# EasyEDA schematic 1-Schematic_Plawas-m.json
TITLE: Sheet_1; REV: 1.0; Date: 2019-08-25; Sheet: 1/1; Drawn By: dchamel; Company: Your Company
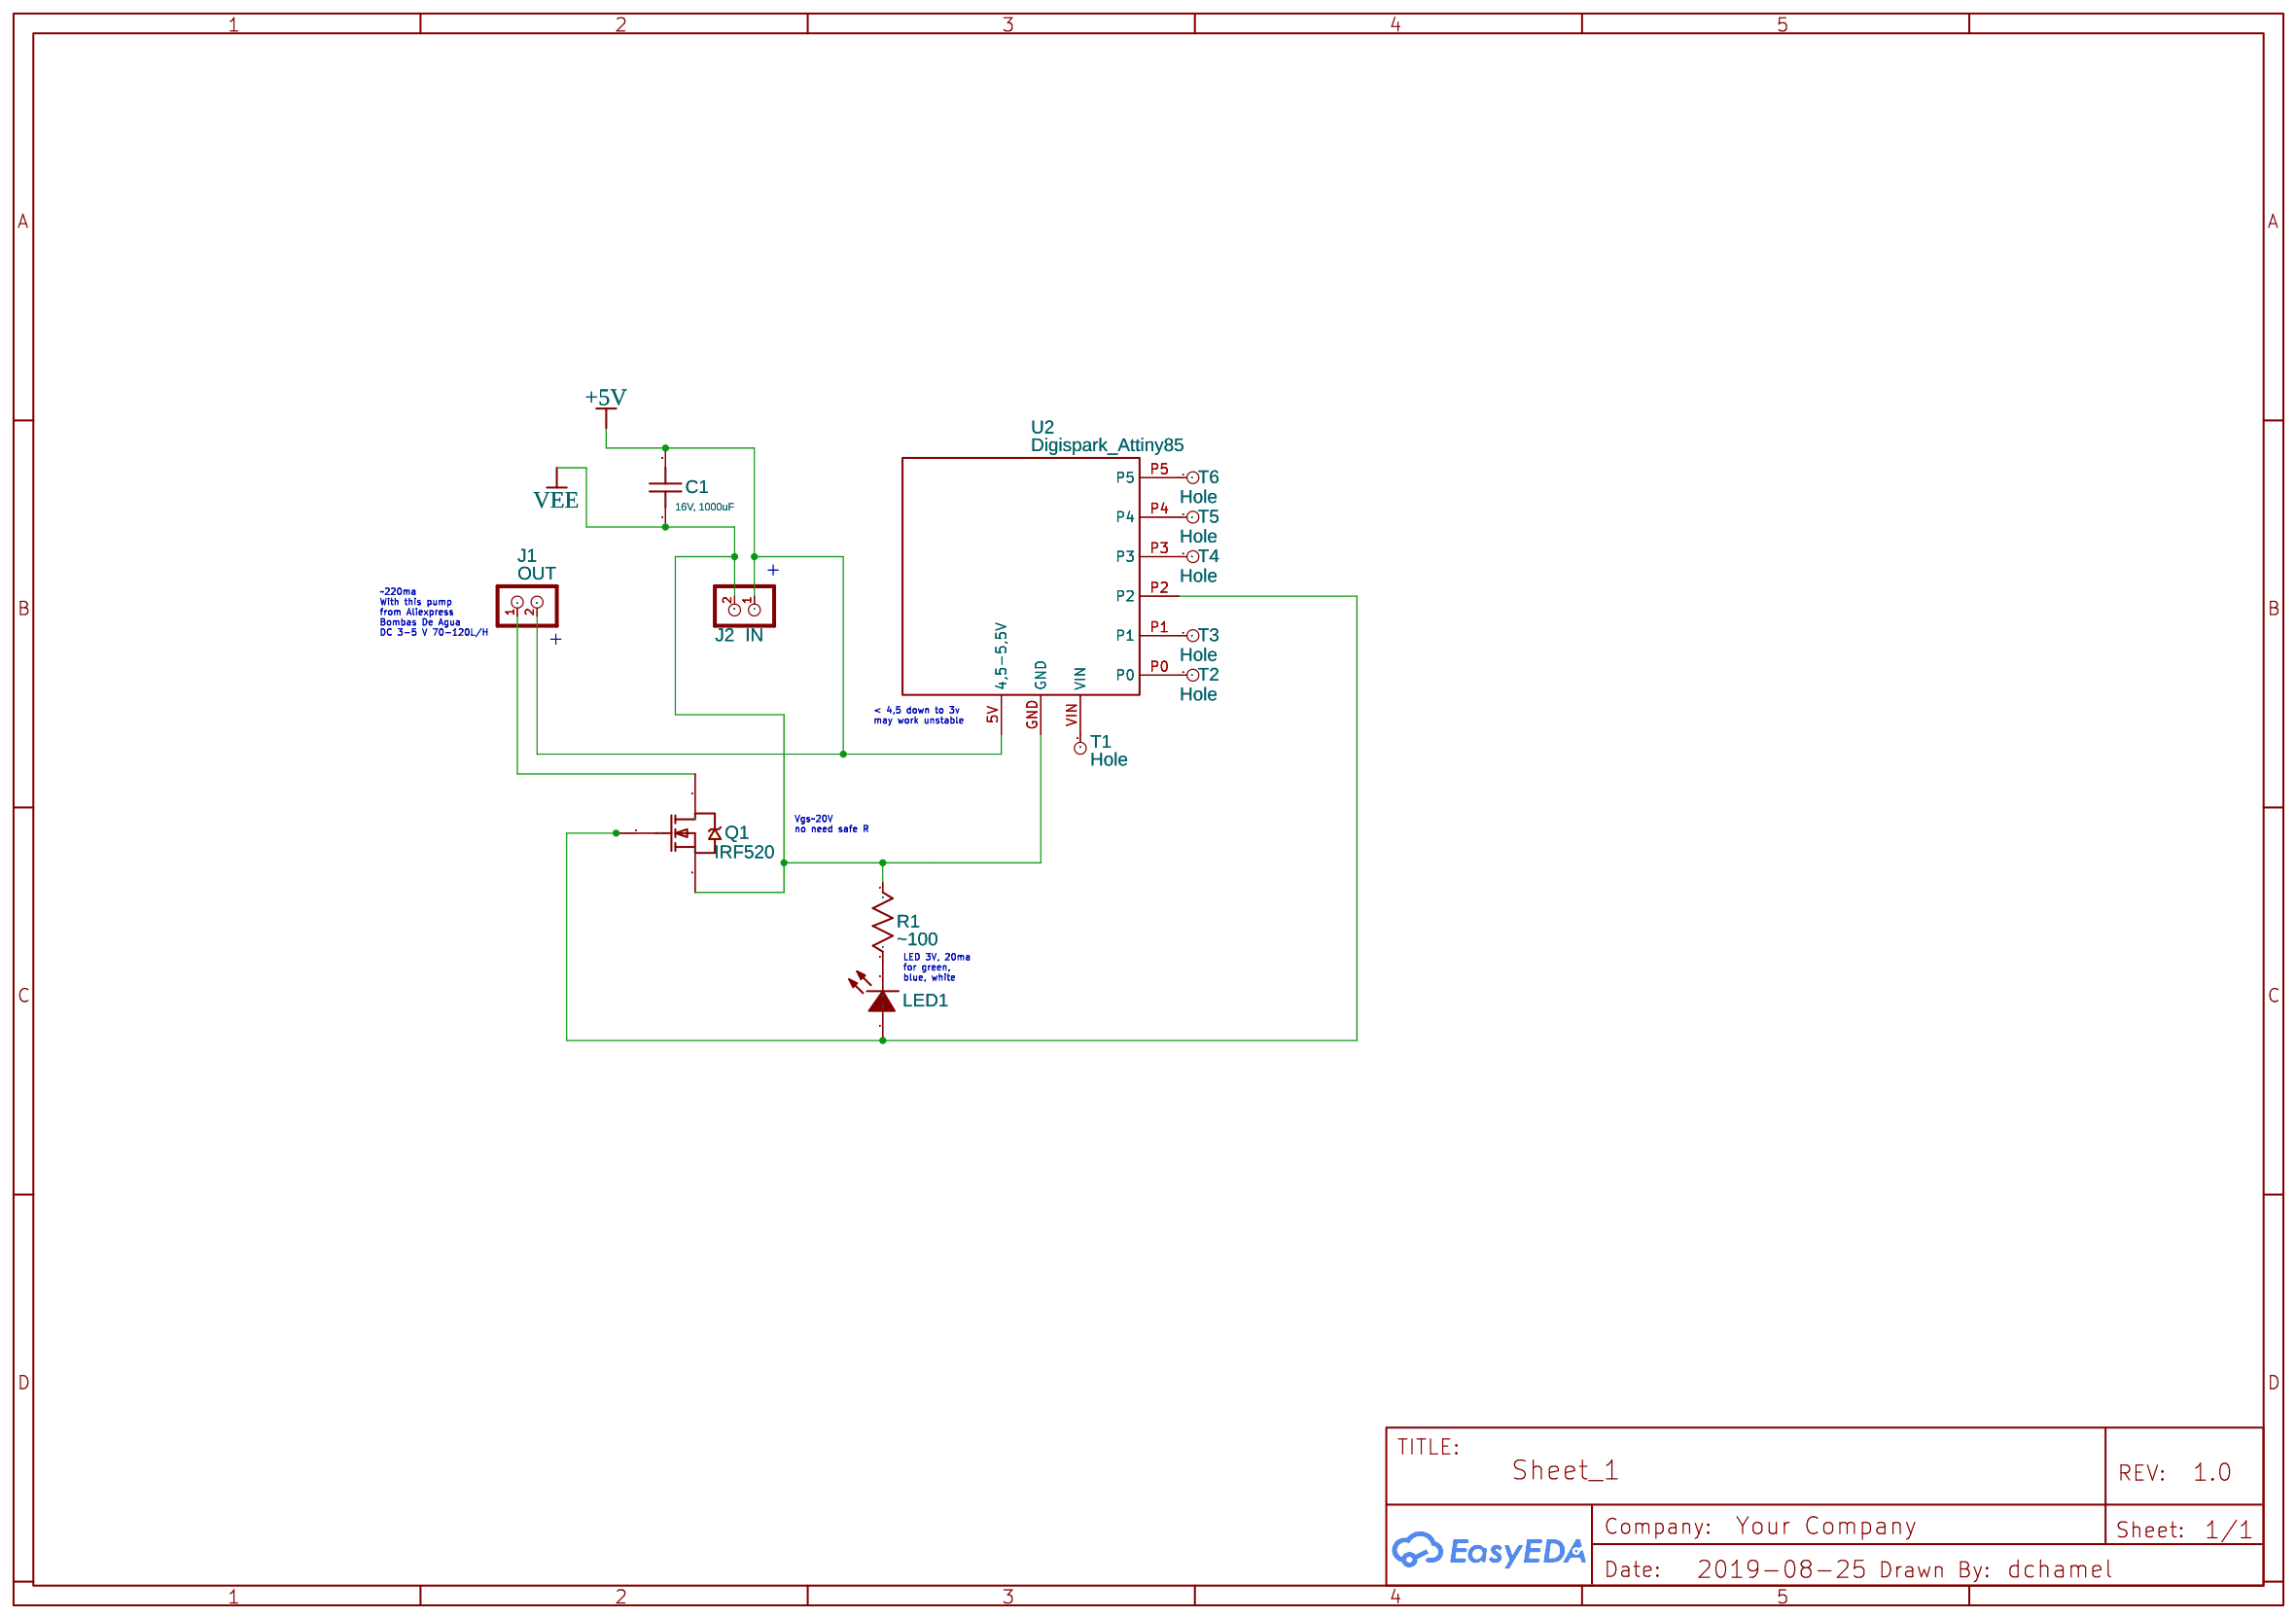
[diagram p0: schematic sheet]

## Parts
C1  16V, 1000uF  [RAD-0.1]
J1  OUT  [TERMINAL_BLOCK_2P_5]
J2  IN  [TERMINAL_BLOCK_2P_5]
LED1  204-10SURD/S530-A3  [LED-3MM/2.54]
Q1  IRF520  [TO-220AB]
R1  100  [AXIAL-0.3]
T1  Hole  [CON_PAD_ROUND_32MIL]
T2  Hole  [CON_PAD_ROUND_32MIL]
T3  Hole  [CON_PAD_ROUND_32MIL]
T4  Hole  [CON_PAD_ROUND_32MIL]
T5  Hole  [CON_PAD_ROUND_32MIL]
T6  Hole  [CON_PAD_ROUND_32MIL]
U2  Digispark_Attiny85  [DIGISPARK ATTINY85]

## Library data of the parts
C1 = Cap_RAD-0.1_US
J1 J2 = CON_TERMINAL_BLOCK_02-5MM: 2 poles wire to board terminal block; Contributor: DangerousPrototype
LED1 = 204-10SURD/S530-A3: Supplier: LCSC; Manufacturer: EVERLIGHT; Supplier Part: C99772
Q1 = IRF520: HEXFET N-Channel Power MOSFET
R1 = Res_AXIAL-0.3(1/8W)_US
T1-T6 = PAD_TERMINAL: Contributor: DangerousPrototype
U2 = -: Contributor: alvente

## Nets
+5V: C1.2 J1.2 J2.1 U2.5V(4,5-5,5V)
VEE: C1.1 J2.2 Q1.3(S) R1.2 U2.GND
Net-(J1-1): J1.1 Q1.2(D)
Net-(LED1-1): LED1.1(A) Q1.1(G) U2.P2
Net-(LED1-2): LED1.2(K) R1.1
Net-(T1-P): T1.P U2.VIN
Net-(T2-P): T2.P U2.P0
Net-(T3-P): T3.P U2.P1
Net-(T4-P): T4.P U2.P3
Net-(T5-P): T5.P U2.P4
Net-(T6-P): T6.P U2.P5

## Notes on the sheet
- +
- ~220ma
  With this pump
  from Aliexpress
  Bombas De Agua
  DC 3-5 V 70-120L/H
- +
- < 4,5 down to 3v
  may work unstable
- Vgs~20V
  no need safe R
- LED 3V, 20ma
  for green,
  blue, white
